# EAGLE design LitKit (EAGLE 9.5.1)
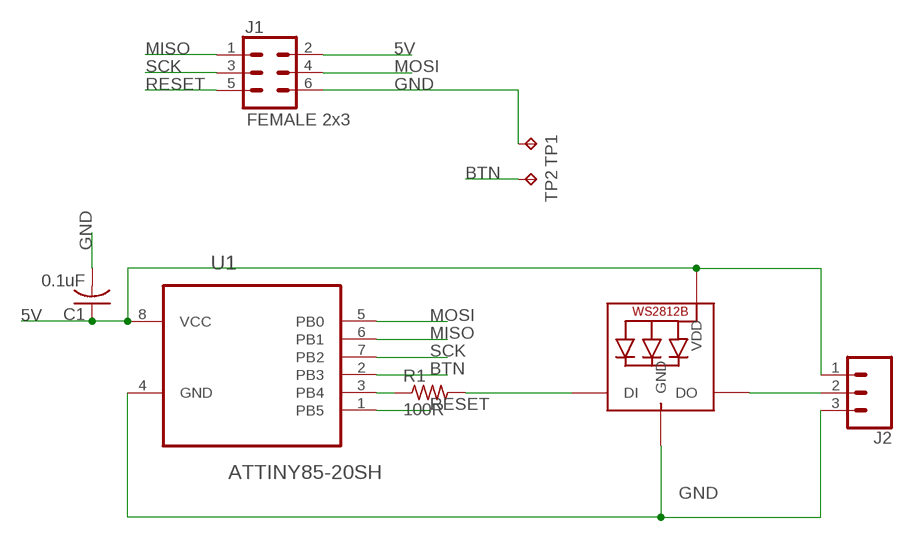
[diagram p0: schematic, sheet 1]

## Parts
C1  0.1uF  C-USC0805  [C0805]
J1  FEMALE 2x3  CONN_03X2FEMALE  [2X3]
J2  CONN_031X03_NO_SILK  [1X03_NO_SILK]
LED1  WS2812B3535  [LED3535]
R1  100R  R-US_R0805  [R0805]
TP1  TPB1,27  [B1,27]
TP2  TPB1,27  [B1,27]
U1  ATTINY85-20SH  [SOIC127P798X216-8N]

## Nets
5V: C1.1 J1.2 J2.1 LED1.2(VDD) U1.8(VCC)
BTN: TP2.TP U1.2(PB3)
GND: C1.2 J1.6 J2.3 LED1.4(GND) TP1.TP U1.4(GND)
MISO: J1.1 U1.6(PB1)
MOSI: J1.4 U1.5(PB0)
N$1: J2.2 LED1.3(DO)
N$2: R1.1 U1.3(PB4)
N$3: LED1.1(DI) R1.2
RESET: J1.5 U1.1(PB5)
SCK: J1.3 U1.7(PB2)

## Library data of the parts
C1 = rcl:C-US: CAPACITOR, American symbol; SPICEPREFIX: C
J1 = 2x3PostStyle:CONN_03X2: Multi connection point. Often used as Generic Header-pin footprint for 0.1 inch spaced/style header connections You can populate with any combo of single row headers, but if you'd like an exact match, check these: Header - 2x3 (Male, 0.1") <https://www.sparkfun.com/products/12807> (PRT-12807) Header - 2x3 (Female, 0.1") <https://www.sparkfun.com/products/13010> (PRT-13010) 2x3 Pin Shrouded Header <https://www.sparkfun.com/products/10877> (PRT-10877) On any of the 0.1 inch spaced packages, you can populate with these: Break Away Headers - Straight <https://www.sparkfun.com/products/116> (PRT-00116) Break Away Male Headers - Right Angle <https://www.sparkfun.com/products/553> (PRT-00553) Female Headers <https://www.sparkfun.com/products/115> (PRT-00115) Break Away Headers - Machine Pin <https://www.sparkfun.com/products/117> (PRT-00117) Break Away Female Headers - Swiss Machine Pin <https://www.sparkfun.com/products/743> (PRT-00743) Special note: the shrouded connector mates well with our 3x2 ribbon cables: Ribbon Crimp Connector - 6-pin (2x3, Female) <https://www.sparkfun.com/products/10651> (PRT-10651) Ribbon Cable - 6 wire (15ft) <https://www.sparkfun.com/products/10646> (PRT-10646); PROD_ID: CONN-11566
J2 = 2x3PostStyle:CONN_03: Multi connection point. Often used as Generic Header-pin footprint for 0.1 inch spaced/style header connections On any of the 0.1 inch spaced packages, you can populate with these: Break Away Headers - Straight <https://www.sparkfun.com/products/116> (PRT-00116) Break Away Male Headers - Right Angle <https://www.sparkfun.com/products/553> (PRT-00553) Female Headers <https://www.sparkfun.com/products/115> (PRT-00115) Break Away Headers - Machine Pin <https://www.sparkfun.com/products/117> (PRT-00117) Break Away Female Headers - Swiss Machine Pin <https://www.sparkfun.com/products/743> (PRT-00743) Stackable Header - 3 Pin (Female, 0.1") <https://www.sparkfun.com/products/13875> (PRT-13875) For SCREWTERMINALS and SPRING TERMINALS visit here: Screw Terimnals on SparkFun.com <https://www.sparkfun.com/search/results?term=Screw+Terminals> (5mm/3.5mm/2.54mm spacing) This device is also useful as a general connection point to wire up your design to another part of your project. Our various solder wires solder well into these plated through hole pads. Hook-Up Wire - Assortment (Stranded, 22 AWG) <https://www.sparkfun.com/products/11375> (PRT-11375) Hook-Up Wire - Assortment (Solid Core, 22 AWG) <https://www.sparkfun.com/products/11367> (PRT-11367) View the entire wire category on our website here <https://www.sparkfun.com/categories/141> Special notes: Molex polarized connector foot print use with SKU : PRT-08232 with associated crimp pins and housings.
LED1 = adafruit:WS2812B
R1 = rcl:R-US_: RESISTOR, American symbol; SPICEPREFIX: R
TP1 TP2 = testpad:TP: Test pad
U1 = ATTINY85-20SH:ATTINY85-20SH: 8-bit Microcontroller with In-System Programmable Flash; AVAILABILITY: Unavailable; DESCRIPTION: Embedded microcontroller ATTINY85-20SH SOIC 8 Microchip Technology 8-Bit 20 MHz I/O number 6; MF: Microchip; MP: ATTINY85-20SH; PACKAGE: SOIC-8 Microchip; PRICE: None

## Board
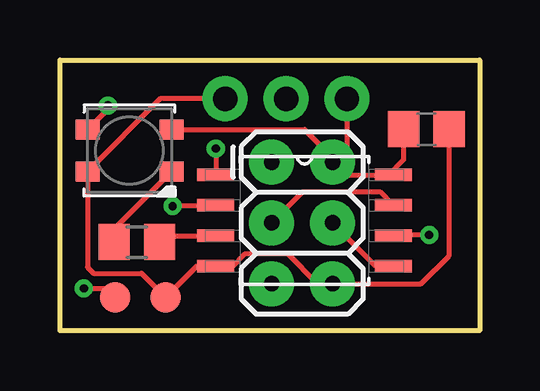
[diagram p1: board, top side]
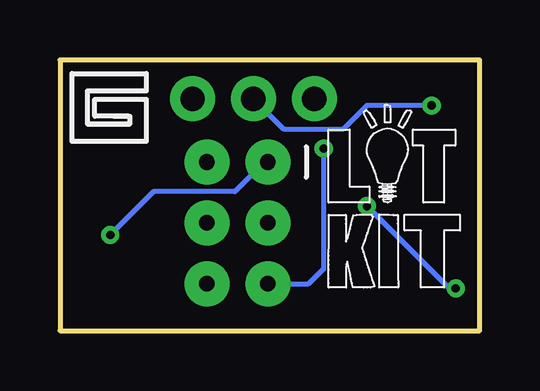
[diagram p2: board, bottom side, seen from below]

Size 17.5 x 11.3 mm. Coordinates in mm from the lower left corner, seen from the top.
Outline: 0,11.3 17.5,11.3 17.5,0 0,0 0,11.3
Copper layers (1*16): Top 0.035mm / dielectric 0.15mm / Bottom 0.035mm
Design rules "default *": minimum track width 6mil, minimum drill 0.35mm, track to track 6mil, track to pad 6mil, pad to pad 6mil, via to via 6mil, smd to smd 6mil, copper to edge 40mil, drill to drill 6mil, minimum pad ring 10mil, minimum via ring 8mil, stop-mask expansion 4mil, vias tented up to drill 36mil, thermal gap 10mil

### Footprints (pad centres in the part's own frame; a part is rotated, then mirrored left to right if it is on the bottom)
C0805 = smd 1.3 x 1.5: 1 -0.95,0; 2 0.95,0
2X3 = drill 0.65 pad 1.88: 1 0,0; 2 0,2.54; 3 2.54,0; 4 2.54,2.54; 5 5.08,0; 6 5.08,2.54
1X03_NO_SILK = drill 1.016 pad 1.88: 1 0,0; 2 2.54,0; 3 5.08,0
LED3535 = smd 1 x 0.85: 1 -1.75,0.875; 2 -1.75,-0.875; 3 1.75,-0.875; 4 1.75,0.875
R0805 = smd 1.3 x 1.5: 1 -0.95,0; 2 0.95,0
B1,27 = smd 1.27 x 1.27: TP 0,0
SOIC127P798X216-8N = smd 1.549 x 0.533: 1 -3.708,1.905; 2 -3.708,0.635; 3 -3.708,-0.635; 4 -3.708,-1.905; 5 3.708,-1.905; 6 3.708,-0.635; 7 3.708,0.635; 8 3.708,1.905

### Placement (x,y rotation side)
C1  15.28,8.41 0 top
J1  8.83,7.04 270 top
J2  11.97,9.68 180 top
LED1  2.9,7.52 180 top
R1  3.21,3.7 180 top
TP1  4.4,1.4 0 top
TP2  2.3,1.4 0 top
U1  10.2,4.6 0 top
U$1  [LITKIT]  6.3,1.8 0 bottom
U$2  [LKGB]  17,7.9 0 bottom

### Tracks (layer width: path | path; a pad name or v marks a point on that pad's centre or on a via)
5V
  Top 0.203: J1.2 11.45,6.96 | 11.45,6.96 11.9,6.51 13.7,6.51 | 13.7,6.51 U1.8 | J2.1 11.97,7.47 11.55,7.05 | 11.55,7.05 11.45,6.96 | LED1.2 10.21,8.4 11.55,7.05 | C1.1 14.33,7.13 13.7,6.51
BTN  (via drill 0.35)
  Top 0.203: U1.2 6.46,5.2 v4.7,5.2 | v1,1.77 1.93,1.77 TP2.TP
  Bottom 0.203: v4.7,5.2 1.27,1.77 v1,1.77
GND
  Top 0.203: J2.3 4.18,9.68 LED1.4 1.15,2.65 1.4,2.4 3.4,2.4 TP1.TP 5.69,2.7 U1.4 7.19,2.7 7.7,3.2 9.5,3.2 10.74,1.96 J1.6 15.06,1.96 16.23,3.13 C1.2
MISO  (via drill 0.35)
  Top 0.203: v15.4,4 13.94,4 U1.6
  Bottom 0.203: J1.1 8.96,7.04 10.2,5.8 13.6,5.8 v15.4,4
MOSI
  Top 0.203: U1.5 13.17,2.7 J1.4
N$1  (via drill 0.35)
  Top 0.203: LED1.3 2,9.24 v2,9.4
  Bottom 0.203: v2,9.4 4.7,9.4 5.7,8.4 8.15,8.4 J2.2
N$2
  Top 0.203: R1.1 4.42,3.96 U1.3
N$3
  Top 0.203: LED1.1 2.26,4.26 R1.2
RESET  (via drill 0.35)
  Top 0.203: v6.5,7.6 6.5,6.51 U1.1
  Bottom 0.203: J1.5 7.14,1.96 6.5,2.6 v6.5,7.6
SCK
  Top 0.203: J1.3 10.13,5.8 13.34,5.8 U1.7